# Altium schematic sheet Connectors — копия.SchDoc
size 420 x 297 mm
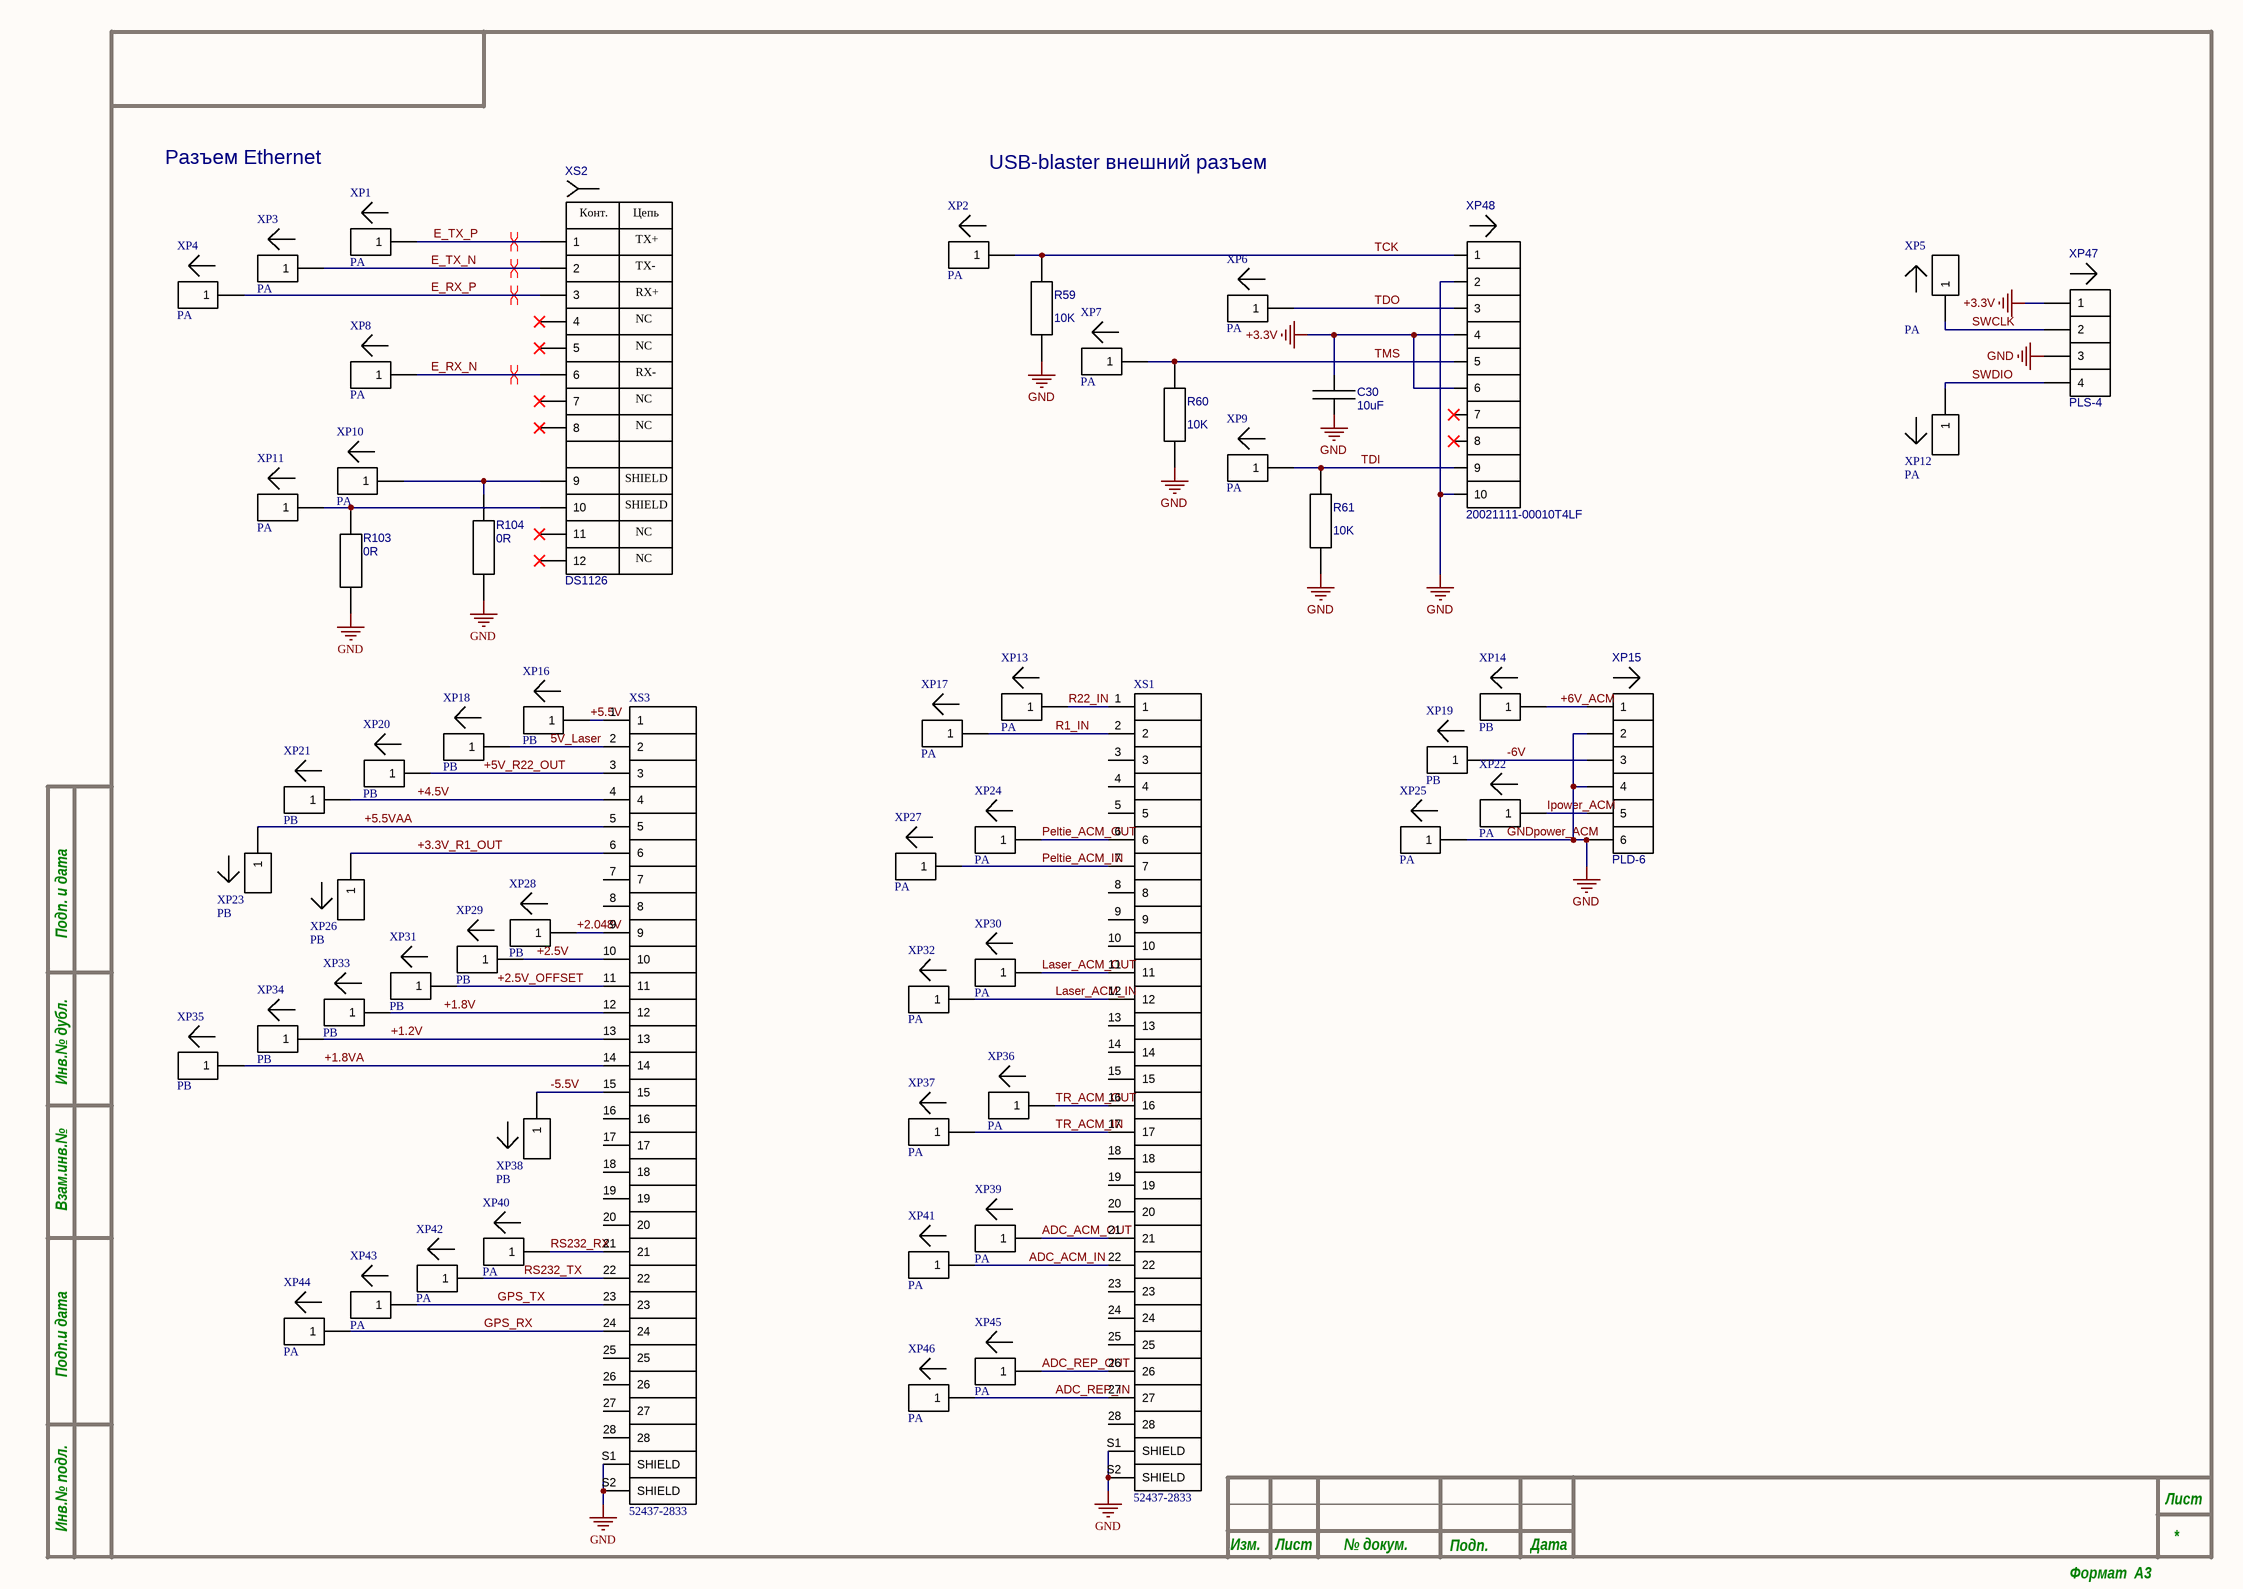
[diagram p0: Connectors — копия.SchDoc]

## Parts
C30  10uF  [0402C]
R59  10K  [R0402]
R60  10K  [R0402]
R61  10K  [R0402]
R103  0R  [R0402]
R104  0R  [R0402]
XP1  PA  [POGO PIN P100-A2/B1]
XP2  PA  [POGO PIN P100-A2/B1]
XP3  PA  [POGO PIN P100-A2/B1]
XP4  PA  [POGO PIN P100-A2/B1]
XP5  PA  [POGO PIN P100-A2/B1]
XP6  PA  [POGO PIN P100-A2/B1]
XP7  PA  [POGO PIN P100-A2/B1]
XP8  PA  [POGO PIN P100-A2/B1]
XP9  PA  [POGO PIN P100-A2/B1]
XP10  PA  [POGO PIN P100-A2/B1]
XP11  PA  [POGO PIN P100-A2/B1]
XP12  PA  [POGO PIN P100-A2/B1]
XP13  PA  [POGO PIN P100-A2/B1]
XP14  PB  [POGO PIN P100-A2/B1]
XP15  PLD-6  [PLD-6]
XP16  PB  [POGO PIN P100-A2/B1]
XP17  PA  [POGO PIN P100-A2/B1]
XP18  PB  [POGO PIN P100-A2/B1]
XP19  PB  [POGO PIN P100-A2/B1]
XP20  PB  [POGO PIN P100-A2/B1]
XP21  PB  [POGO PIN P100-A2/B1]
XP22  PA  [POGO PIN P100-A2/B1]
XP23  PB  [POGO PIN P100-A2/B1]
XP24  PA  [POGO PIN P100-A2/B1]
XP25  PA  [POGO PIN P100-A2/B1]
XP26  PB  [POGO PIN P100-A2/B1]
XP27  PA  [POGO PIN P100-A2/B1]
XP28  PB  [POGO PIN P100-A2/B1]
XP29  PB  [POGO PIN P100-A2/B1]
XP30  PA  [POGO PIN P100-A2/B1]
XP31  PB  [POGO PIN P100-A2/B1]
XP32  PA  [POGO PIN P100-A2/B1]
XP33  PB  [POGO PIN P100-A2/B1]
XP34  PB  [POGO PIN P100-A2/B1]
XP35  PB  [POGO PIN P100-A2/B1]
XP36  PA  [POGO PIN P100-A2/B1]
XP37  PA  [POGO PIN P100-A2/B1]
XP38  PB  [POGO PIN P100-A2/B1]
XP39  PA  [POGO PIN P100-A2/B1]
XP40  PA  [POGO PIN P100-A2/B1]
XP41  PA  [POGO PIN P100-A2/B1]
XP42  PA  [POGO PIN P100-A2/B1]
XP43  PA  [POGO PIN P100-A2/B1]
XP44  PA  [POGO PIN P100-A2/B1]
XP45  PA  [POGO PIN P100-A2/B1]
XP46  PA  [POGO PIN P100-A2/B1]
XP47  PLS-4  [PLS-4]
XP48  20021111-00010T4LF  [20021111-00010T4LF]
XS1  52437-2833  [MOLEX_52437-2833]
XS2  DS1126  [DS1126]
XS3  52437-2833  [MOLEX_52437-2833]

## Nets
+3.3V: C30.2 XP47.1 XP48.4 XP48.6
GNDpower_ACM: C30.1 R59.1 R60.1 R61.1 R103.1 R104.1 XP15.2 XP15.4 XP15.6 XP25.1 XP47.3 XP48.2 XP48.10 XS1.S1(SHIELD) XS1.S2(SHIELD) XS3.S1(SHIELD) XS3.S2(SHIELD)  [also labelled GND]
5V_Laser: XP18.1 XS3.2
+1.2V: XP34.1 XS3.13
+1.8V: XP33.1 XS3.12
+1.8VA: XP35.1 XS3.14
+2.5V: XP29.1 XS3.10
+2.5V_OFFSET: XP31.1 XS3.11
+2.048V: XP28.1 XS3.9
+3.3V_R1_OUT: XP26.1 XS3.6
+4.5V: XP21.1 XS3.4
+5.5V: XP16.1 XS3.1
+5.5VAA: XP23.1 XS3.5
+5V_R22_OUT: XP20.1 XS3.3
+6V_ACM: XP14.1 XP15.1
-5.5V: XP38.1 XS3.15
-6V: XP15.3 XP19.1
ADC_ACM_IN: XP41.1 XS1.22
ADC_ACM_OUT: XP39.1 XS1.21
ADC_REP_IN: XP46.1 XS1.27
ADC_REP_OUT: XP45.1 XS1.26
E_RX_N: XP8.1 XS2.6
E_RX_P: XP4.1 XS2.3
E_TX_N: XP3.1 XS2.2
E_TX_P: XP1.1 XS2.1
GPS_RX: XP44.1 XS3.24
GPS_TX: XP43.1 XS3.23
Ipower_ACM: XP15.5 XP22.1
Laser_ACM_IN: XP32.1 XS1.12
Laser_ACM_OUT: XP30.1 XS1.11
Peltie_ACM_IN: XP27.1 XS1.7
Peltie_ACM_OUT: XP24.1 XS1.6
R1_IN: XP17.1 XS1.2
R22_IN: XP13.1 XS1.1
RS232_RX: XP40.1 XS3.21
RS232_TX: XP42.1 XS3.22
SWCLK: XP5.1 XP47.2
SWDIO: XP12.1 XP47.4
TCK: R59.2 XP2.1 XP48.1
TDI: R61.2 XP9.1 XP48.9
TDO: XP6.1 XP48.3
TMS: R60.2 XP7.1 XP48.5
TR_ACM_IN: XP37.1 XS1.17
TR_ACM_OUT: XP36.1 XS1.16
NetR103_2: R103.2 XP11.1 XS2.10
NetR104_2: R104.2 XP10.1 XS2.9

Not connected (* = marked no-connect by the designer): XP48 7* 8*; XS1 3 4 5 8 9 10 13 14 15 18 19 20 23 24 25 28; XS2 4* 5* 7* 8* 11* 12*; XS3 7 8 16 17 18 19 20 25 26 27 28

## Layout directives
differential pair: E_RX_N, E_RX_P, E_TX_N, E_TX_P

## Notes on the sheet
- Разъем Ethernet
- USB-blaster внешний разъем
- Подп. и дата
- Инв.№ дубл.
- Взам.инв.№
- Подп.и дата
- Инв.№ подл.
- Изм.
- Лист
- № докум.
- Подп.
- Дата
- Формат  A3
- (in symbol DS1126) Конт.; Цепь; TX+; TX-; RX+; NC; RX-; SHIELD

## Library data of the parts
C30 = C0402-10UF 10% 10V: Part Number: SMD CAP CER 10UF ±10% 10V X5R 0402; Added_by: Rutel@Mail.ru; Solder_Amount: 2; Pkg: 0402; Created_at: 27/03/2020; MountType: SMD; Mount: MOUNT
R59-R61 = R0402-10K: Resistor SMD 10K 1% 0402; Part Number: SMD RES 10 KOHM 1% ±100ppm/°C 0402; Added_by: Rutel@teslatec.ru; Solder_Amount: 2; Pkg: 0402; Created_at: 21/04/2020; MountType: SMD; Mount: MOUNT
R103 R104 = R0402-0R: Resistor SMD 0R 1% 0402; Part Number: SMD RES 0R 0402; Added_by: irdolgopolowa@yandex.ru; Solder_Amount: 2; Pkg: 0402; Created_at: 29/10/24; MountType: SMD; Mount: MOUNT
XP1-XP13 XP17 XP22 XP24 XP25 XP27 XP30 XP32 XP36 XP37 XP39-XP46 = P100-A2 / P100-A: Pogo pin, 33.35x1.36; Added_by: irdolgopolowa@yandex.ru; Created_at: 29/10/24; Mount: MOUNT; MountType: THM; Part Number: P100-A2 / P100-A; Pkg: *
XP14 XP16 XP18-XP21 XP23 XP26 XP28 XP29 XP31 XP33-XP35 XP38 = P100-B1: Pogo pin, 33.35x1.36; Added_by: irdolgopolowa@yandex.ru; Created_at: 29/10/24; Mount: MOUNT; MountType: THM; Part Number: P100-B1; Pkg: *
XP15 = PLD-6: Pin Header Pitch 2.54mm; Part Number: PLD-6 (DS1021-2x3); Pkg: PLD-6 2.54mm; Solder_Amount: 6; Added_by: ponomarev_ke@teslatec.ru; MountType: THM; Mount: MOUNT; Mating Part: *; Mating Terminals: *; Cable/Wire: *; Created_at: 21/05/2019
XP47 = PLS-4: HEADER 2.54mm; Mating Part: BLS-4; Added_by: irdolgopolowa@yandex.ru; Solder_Amount: 4; Mating Terminals: BL-T (DS-1071); Cable/Wire: МГТФ 0,35 кв.мм ГОСТ; Created_at: 29/10/24; Mount: MOUNT; MountType: THM; Part Number: PLS-4; Pkg: PLS-4
XP48 = 20021111-00010T4LF: 20021111-00010T4LF. pin 10; Added_by: irdolgopolowa@yandex.ru; Solder_Amount: 10; Created_at: 29/10/24; Mount: MOUNT; MountType: THM; Pkg: 20021111-00010T4LF; Part Number: 20021111-00010T4LF
XS1 XS3 = 52437-2833: 28 Position FFC, FPC Connector Contacts, Bottom 0.020 _0.50mm_ Surface Mount, Right Angle; Part Number: 52437-2833 (MOLEX); Mating Part: FFCA 28pin, 0.5mm pitch, AVM 20624 80C 60V VW-1; Solder_Amount: 30; Added_by: ridel_av@teslatec.ru; Mount: MOUNT; MountType: SMD; Pkg: 52437-2833
XS2 = DS1126: Ethernet PCB 8/8 RJ45; Added_by: irdolgopolowa@yandex.ru; Solder_Amount: 12; Pkg: RJ-45; Created_at: 29/10/24; Mount: MOUNT; MountType: THM; Part Number: DS1126